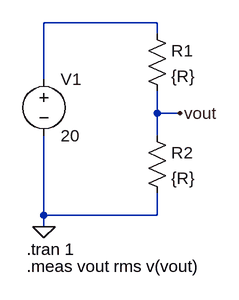
[diagram p0: schematic test_run.asc]
test_run.asc, the LTspice schematic file:
Version 4
SHEET 1 880 680
WIRE 144 48 -16 48
WIRE 144 64 144 48
WIRE -16 128 -16 48
WIRE 144 176 144 144
WIRE 176 176 144 176
WIRE 144 208 144 176
WIRE -16 320 -16 208
WIRE 144 320 144 288
WIRE 144 320 -16 320
WIRE -16 336 -16 320
FLAG -16 336 0
FLAG 176 176 vout
SYMBOL voltage -16 112 R0
WINDOW 123 24 124 Left 2
WINDOW 39 0 0 Left 0
SYMATTR InstName V1
SYMATTR Value 20
SYMBOL res 128 48 R0
SYMATTR InstName R1
SYMATTR Value {R}
SYMBOL res 128 192 R0
SYMATTR InstName R2
SYMATTR Value {R}
TEXT -40 368 Left 2 !.tran 1
TEXT -40 392 Left 2 !.meas vout rms v(vout)

The netlist it stands for:
* test_run.asc
V1 N001 0 20
R1 N001 vout {R}
R2 vout 0 {R}
.tran 1
.meas vout rms v(vout)
.backanno
.end